# Altium project altium_v4.PrjPCB (part 1 of 2)
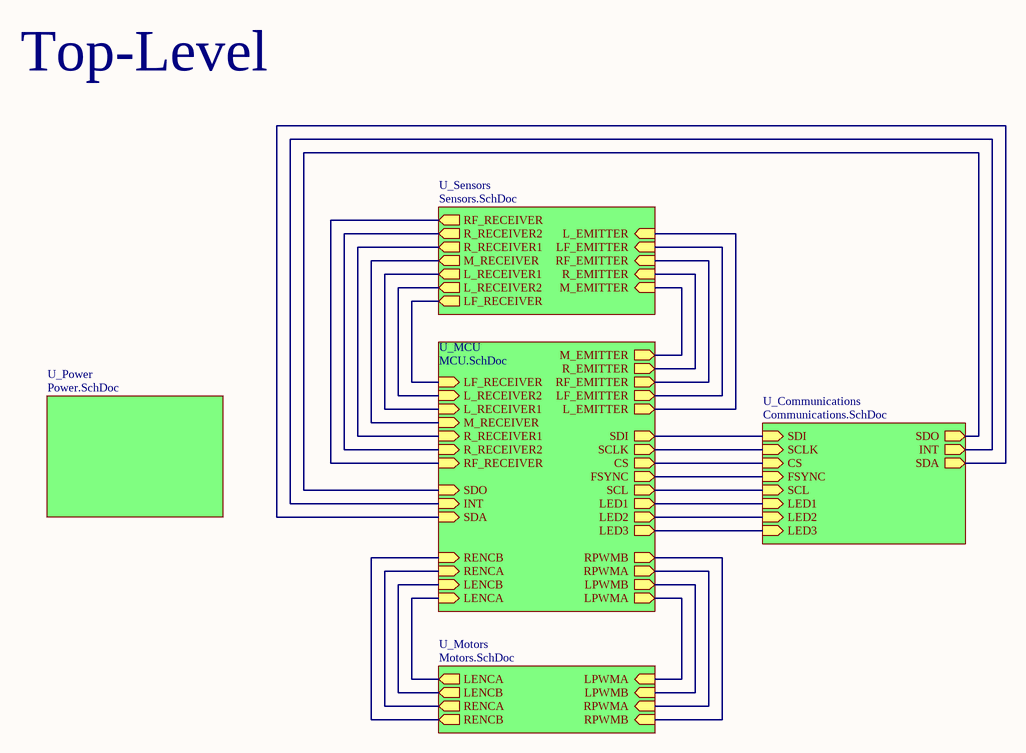
[diagram p0: Micromouse_Altium_v4.SchDoc]
6 sheets, 142 parts. Net scope: hierarchical (ports join the sheet entries above them; power ports are global).
Board file: Micromouse_Altium_v4.PcbDoc
Sheets:
  Micromouse_Altium_v4.SchDoc
    U_Motors = Motors.SchDoc
    U_Power = Power.SchDoc
    U_Sensors = Sensors.SchDoc
    U_MCU = MCU.SchDoc
    U_Communications = Communications.SchDoc

## Sheet Micromouse_Altium_v4.SchDoc
size A

### Sub-sheets
U_Communications = Communications.SchDoc: SDI (in), SCLK (in), CS (in), SDO (out), INT (out), FSYNC (in), SDA (out), SCL (in), LED1 (in), LED2 (in), LED3 (in)
U_MCU = MCU.SchDoc: SDI (out), SDO (in), SCLK (out), CS (out), FSYNC (out), INT (in), SCL (out), SDA (in), LENCA (in), LENCB (in), RENCA (in), RENCB (in), LPWMA (out), LPWMB (out), L_EMITTER (out), LF_EMITTER (out), M_EMITTER (out), R_EMITTER (out), RF_EMITTER (out), L_RECEIVER1 (in), L_RECEIVER2 (in), LF_RECEIVER (in), R_RECEIVER1 (in), R_RECEIVER2 (in), RF_RECEIVER (in), M_RECEIVER (in), RPWMA (out), RPWMB (out), LED1 (out), LED2 (out), LED3 (out)
U_Motors = Motors.SchDoc: LPWMA (in), LPWMB (in), LENCA (out), LENCB (out), RPWMA (in), RPWMB (in), RENCA (out), RENCB (out)
U_Power = Power.SchDoc: no entries
U_Sensors = Sensors.SchDoc: L_EMITTER (in), LF_EMITTER (in), RF_EMITTER (in), R_EMITTER (in), M_EMITTER (in), RF_RECEIVER (out), R_RECEIVER2 (out), R_RECEIVER1 (out), M_RECEIVER (out), L_RECEIVER1 (out), L_RECEIVER2 (out), LF_RECEIVER (out)

### Nets
NetIC1_9: sheet U_MCU/SDO, sheet U_Communications/SDO
NetIC1_11: sheet U_MCU/FSYNC, sheet U_Communications/FSYNC
NetIC1_12: sheet U_MCU/INT, sheet U_Communications/INT
NetIC1_22: sheet U_MCU/CS, sheet U_Communications/CS
NetIC1_23: sheet U_MCU/SCLK, sheet U_Communications/SCLK
NetIC1_24: sheet U_MCU/SDI, sheet U_Communications/SDI
NetIC2_1: sheet U_MCU/LED1, sheet U_Communications/LED1
NetIC3_1: sheet U_MCU/LED2, sheet U_Communications/LED2
NetIC4_1: sheet U_MCU/LED3, sheet U_Communications/LED3
NetIC5_2: sheet U_Motors/LPWMA, sheet U_MCU/LPWMA
NetIC5_4: sheet U_Motors/LPWMB, sheet U_MCU/LPWMB
NetIC6_2: sheet U_Motors/RPWMA, sheet U_MCU/RPWMA
NetIC6_4: sheet U_Motors/RPWMB, sheet U_MCU/RPWMB
NetIC10_1: sheet U_Sensors/L_EMITTER, sheet U_MCU/L_EMITTER
NetIC11_1: sheet U_Sensors/LF_EMITTER, sheet U_MCU/LF_EMITTER
NetIC12_1: sheet U_Sensors/RF_EMITTER, sheet U_MCU/RF_EMITTER
NetIC13_1: sheet U_Sensors/R_EMITTER, sheet U_MCU/R_EMITTER
NetIC14_1: sheet U_Sensors/M_EMITTER, sheet U_MCU/M_EMITTER
NetJ2_4: sheet U_Motors/LENCA, sheet U_MCU/LENCA
NetJ2_5: sheet U_Motors/LENCB, sheet U_MCU/LENCB
NetJ3_4: sheet U_Motors/RENCA, sheet U_MCU/RENCA
NetJ3_5: sheet U_Motors/RENCB, sheet U_MCU/RENCB
NetQ3_1: sheet U_Sensors/LF_RECEIVER, sheet U_MCU/LF_RECEIVER
NetQ4_1: sheet U_Sensors/L_RECEIVER2, sheet U_MCU/L_RECEIVER2
NetQ5_1: sheet U_Sensors/L_RECEIVER1, sheet U_MCU/L_RECEIVER1
NetQ6_1: sheet U_Sensors/M_RECEIVER, sheet U_MCU/M_RECEIVER
NetQ7_1: sheet U_Sensors/R_RECEIVER1, sheet U_MCU/R_RECEIVER1
NetQ8_1: sheet U_Sensors/R_RECEIVER2, sheet U_MCU/R_RECEIVER2
NetQ9_1: sheet U_Sensors/RF_RECEIVER, sheet U_MCU/RF_RECEIVER
NetR9_1: sheet U_MCU/SDA, sheet U_Communications/SDA
NetR11_1: sheet U_MCU/SCL, sheet U_Communications/SCL

### Notes on the sheet
- Top-Level

## Sheet Motors.SchDoc
size A
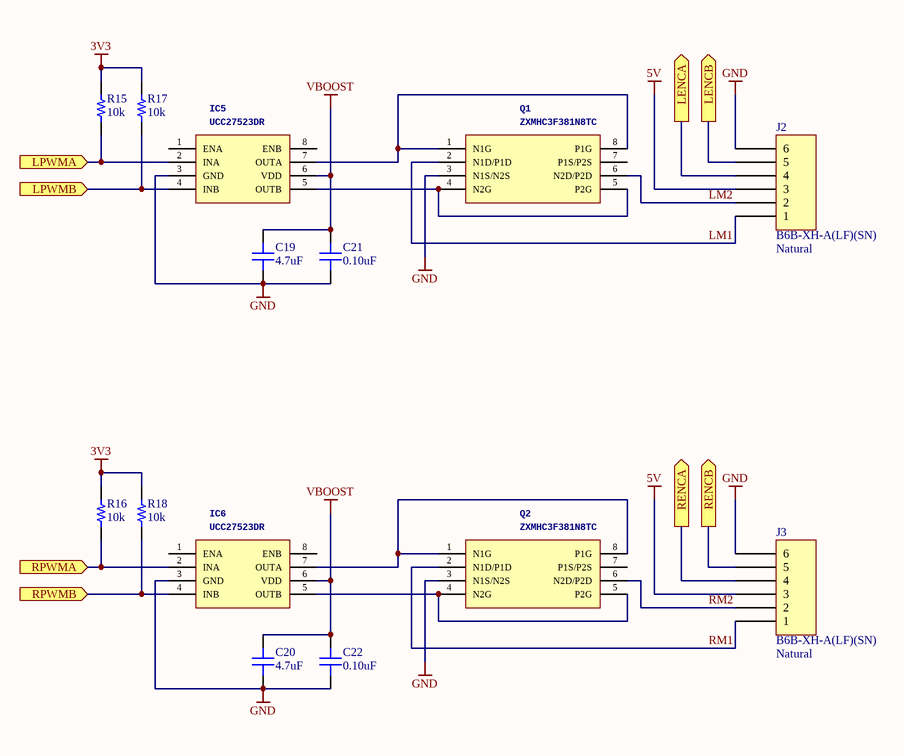
[diagram p1: Motors.SchDoc]

### Parts
C19  4.7uF  [CAP 0805/2012]
C20  4.7uF  [CAP 0805/2012]
C21  0.10uF  [CAP 0402/1005]
C22  0.10uF  [CAP 0402/1005]
IC5  UCC27523DR  [SOIC127P600X175-8N]
IC6  UCC27523DR  [SOIC127P600X175-8N]
J2  B6B-XH-A(LF)(SN)  Colour: Natural  [JST XH B6B-XH-A]
J3  B6B-XH-A(LF)(SN)  Colour: Natural  [JST XH B6B-XH-A]
Q1  ZXMHC3F381N8TC  [SOIC127P600X175-8N]
Q2  ZXMHC3F381N8TC  [SOIC127P600X175-8N]
R15  10k  [RES 0402/1005]
R16  10k  [RES 0402/1005]
R17  10k  [RES 0402/1005]
R18  10k  [RES 0402/1005]

### Ports
LENCA (out), LENCB (out), LPWMA (in), LPWMB (in), RENCA (out), RENCB (out), RPWMA (in), RPWMB (in)

### Nets
3V3: R15.2 R16.2 R17.2 R18.2
5V: J2.3 J3.3
GND: C19.1 C20.1 C21.1 C22.1 IC5.3(GND) IC6.3(GND) J2.6 J3.6 Q1.3(N1S/N2S) Q2.3(N1S/N2S)
VBOOST: C19.2 C20.2 C21.2 C22.2 IC5.6(VDD) IC6.6(VDD)
LM1: J2.1 Q1.2(N1D/P1D)
LM2: J2.2 Q1.6(N2D/P2D)
RM1: J3.1 Q2.2(N1D/P1D)
RM2: J3.2 Q2.6(N2D/P2D)
NetIC5_2: IC5.2(INA) R15.1 ; port LPWMA
NetIC5_4: IC5.4(INB) R17.1 ; port LPWMB
NetIC5_5: IC5.5(OUTB) Q1.4(N2G) Q1.5(P2G)
NetIC5_7: IC5.7(OUTA) Q1.1(N1G) Q1.8(P1G)
NetIC6_2: IC6.2(INA) R16.1 ; port RPWMA
NetIC6_4: IC6.4(INB) R18.1 ; port RPWMB
NetIC6_5: IC6.5(OUTB) Q2.4(N2G) Q2.5(P2G)
NetIC6_7: IC6.7(OUTA) Q2.1(N1G) Q2.8(P1G)
NetJ2_4: J2.4 ; port LENCA
NetJ2_5: J2.5 ; port LENCB
NetJ3_4: J3.4 ; port RENCA
NetJ3_5: J3.5 ; port RENCB

Not connected (* = marked no-connect by the designer): IC5 1(ENA) 8(ENB); IC6 1(ENA) 8(ENB); Q1 7(P1S/P2S); Q2 7(P1S/P2S)

### Library data of the parts
C19 C20 = CC0805ZRY5V6BB475: CAP CER 4.7UF 10V Y5V 0805; Manufacturer: Yageo; TemperatureRange: -30C ~ 85C; TemperatureCoefficient: Y5V (F); Tolerance: -20%, +80%; Value: 4.7uF; Part Number: CC0805ZRY5V6BB475; PartId: 13806; Supplier 1: Digi-Key; Supplier Part Number 1: 311-1371-2-ND; ComponentLink1Description: Datasheet; ComponentLink1URL: http://www.yageo.com/documents/recent/UPY-GPHC_Y5V_6.3V-to-50V_6.pdf; ComponentLink2Description: Digi-Key Listing; ComponentLink2URL: https://www.digikey.com/product-detail/en/yageo/CC0805ZRY5V6BB475/311-1371-2-ND/2103109; Voltage: 10V; Price: 0.0145; Device Package: 0805 (2012 Metric)
C21 C22 = GCM155R71C104KA55D: CAP CER 0.1UF 16V X7R 0402; Manufacturer: Murata Electronics North America; TemperatureRange: -55C ~ 125C; Tolerance: 10%; Value: 0.10uF; Part Number: GCM155R71C104KA55D; PartId: 12362; Supplier 1: Digi-Key; Supplier Part Number 1: 490-4759-2-ND; ComponentLink1Description: Datasheet; ComponentLink1URL: http://www.murata.com/~/media/webrenewal/support/library/catalog/products/capacitor/mlcc/c03e.ashx; ComponentLink2Description: Digi-Key Listing; ComponentLink2URL: https://www.digikey.com/product-detail/en/murata-electronics-north-america/GCM155R71C104KA55D/490-4759-2-ND/1641633; TemperatureCoefficient: X7R; Voltage: 16V; Price: 0.0088; Device Package: 0402 (1005 Metric)
IC5 IC6 = UCC27523DR: MANUFACTURER_NAME: Texas Instruments; GateName_1: G$1; SymbolName_1: UCC27523DR; LibraryName: micromousev2Parts; DeviceSetName: UCC27523DR; Package: SOIC127P600X175-8N; ARROW_PART_NUMBER: UCC27523DR; ARROW_PRICE/STOCK: https://www.arrow.com/en/products/ucc27523dr/texas-instruments; HEIGHT: 1.75mm; MANUFACTURER_PART_NUMBER: UCC27523DR
J2 J3 = B6B-XH-A(LF)(SN): CONN HEADER XH TOP 6POS 2.5MM; Manufacturer: JST Sales America Inc.; Pitch: 0.098" (2.50mm); Number Of Positions: 6; Part Number: B6B-XH-A(LF)(SN); PartId: 16453; Supplier 1: Digi-Key; Supplier Part Number 1: 455-2271-ND; ComponentLink1Description: Datasheet; ComponentLink1URL: http://www.jst-mfg.com/product/pdf/eng/eXH.pdf; ComponentLink2Description: Digi-Key Listing; ComponentLink2URL: http://www.digikey.com/product-detail/en/jst-sales-america-inc/B6B-XH-A(LF)(SN)/455-2271-ND/1000381; Price: 0.27; Type: Header, Shrouded; Contact Finish: Tin; Fastening Type: Detent Lock; Number Of Rows: 1; Series: XH
Q1 Q2 = ZXMHC3F381N8TC: MANUFACTURER_NAME: Diodes Inc.; GateName_1: G$1; ALLIED_NUMBER: 70438802; SymbolName_1: ZXMHC3F381N8TC; LibraryName: micromousev2Parts; DeviceSetName: ZXMHC3F381N8TC; Package: SOIC127P600X175-8N; ALLIED_PRICE/STOCK: https://www.alliedelec.com/diodes-inc-zxmhc3f381n8tc/70438802/; ARROW_PART_NUMBER: ZXMHC3F381N8TC; ARROW_PRICE/STOCK: https://www.arrow.com/en/products/zxmhc3f381n8tc/diodes-incorporated; HEIGHT: 1.75mm; MANUFACTURER_PART_NUMBER: ZXMHC3F381N8TC; RS_PART_NUMBER: 7515344P; RS_PRICE/STOCK: http://uk.rs-online.com/web/p/products/7515344P
R15-R18 = ERJ-2RKF1002X: RES SMD 10K OHM 1% 1/10W 0402; Manufacturer: Panasonic Electronic Components; TemperatureRange: -55C ~ 155C; TemperatureCoefficient: 100ppm/C; PowerRating: 0.1W, 1/10W; Value: 10k; Part Number: ERJ-2RKF1002X; PartId: 1; Supplier 1: Digi-Key; Supplier Part Number 1: P10.0KLTR-ND; ComponentLink1Description: Datasheet; ComponentLink1URL: http://industrial.panasonic.com/www-cgi/jvcr13pz.cgi?E+PZ+3+AOA0002+ERJ2RKF1002X+7+WW; ComponentLink2Description: Digikey listing; ComponentLink2URL: http://digikey.com/product-detail/en/ERJ-2RKF1002X/P10.0KLTR-ND/192073; Tolerance: 1%; Price: 0.0043; Type: Thick Film; Device Package: 0402 (1005 Metric)

## Sheet Power.SchDoc
size A
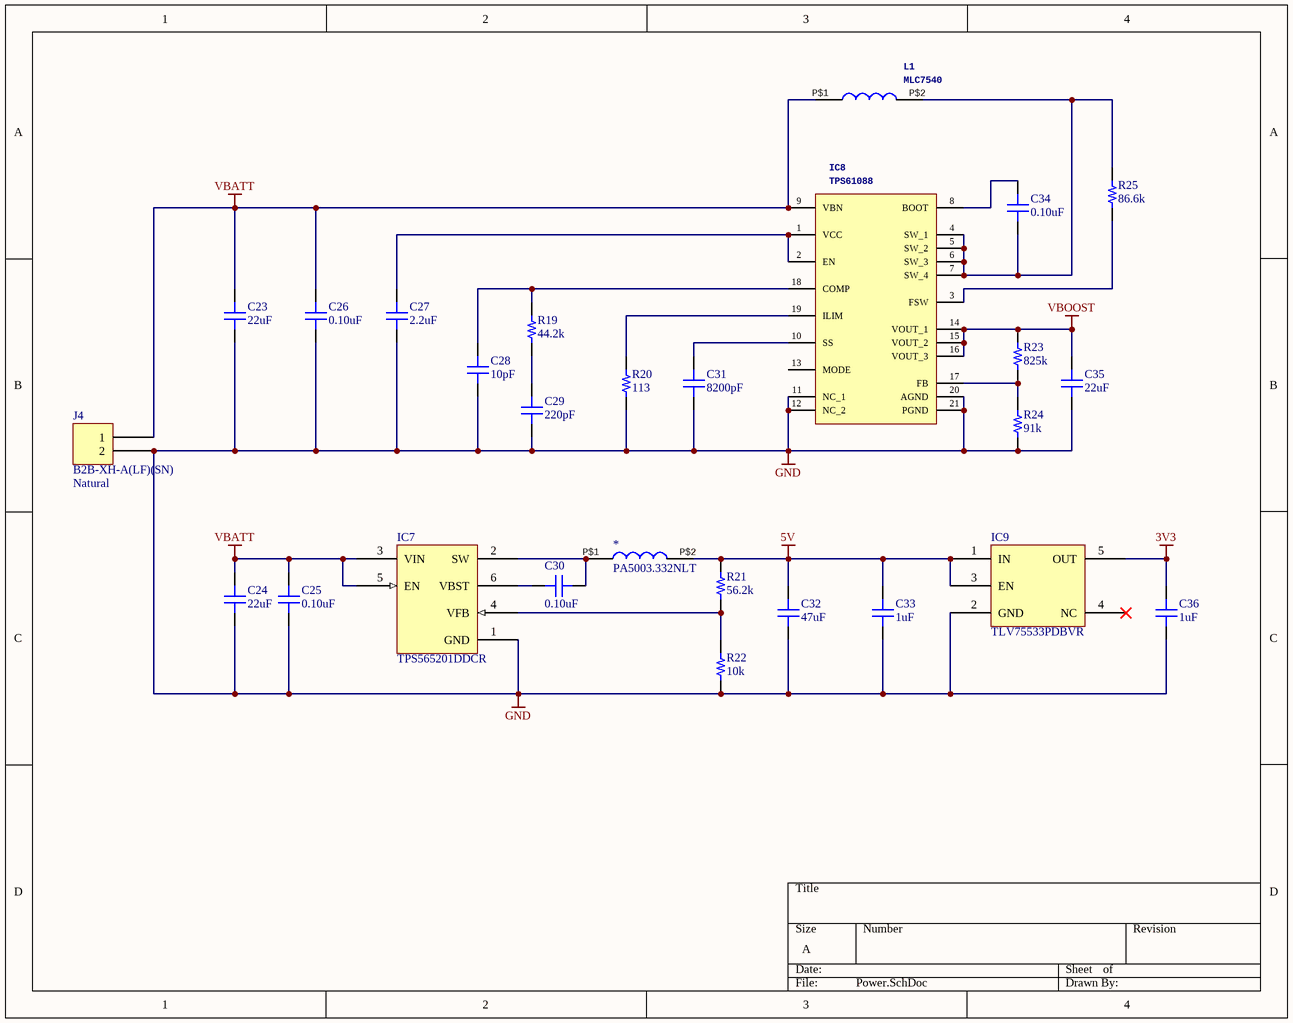
[diagram p2: Power.SchDoc]

### Parts
*  PA5003.332NLT  [PA5003]
C23  22uF  [CAP 1210/3225 - 2.8MM]
C24  22uF  [CAP 0805/2012]
C25  0.10uF  [CAP 0402/1005]
C26  0.10uF  [CAP 0603/1608]
C27  2.2uF  [CAP 0603/1608]
C28  10pF  [CAP 0402/1005]
C29  220pF  [CAP 0402/1005]
C30  0.10uF  [CAP 0402/1005]
C31  8200pF  [CAP 0603/1608]
C32  47uF  [CAP 1206/3216]
C33  1uF  [CAP 0603/1608]
C34  0.10uF  [CAP 0402/1005]
C35  22uF  [CAP 1210/3225 - 2.8MM]
C36  1uF  [CAP 0603/1608]
IC7  TPS565201DDCR  [DDC]
IC8  TPS61088  [RHL(R-PVQFN-N20)_1]
IC9  TLV75533PDBVR  [SOT95P280X145-5N]
J4  B2B-XH-A(LF)(SN)  Colour: Natural  [JST XH B2B-XH-A]
L1  MLC7540  [MLC7540]
R19  44.2k  [RES 0402/1005]
R20  113  [RES 0402/1005]
R21  56.2k  [RES 0402/1005]
R22  10k  [RES 0402/1005]
R23  825k  [RES 0402/1005]
R24  91k  [RES 0402/1005]
R25  86.6k  [RES 0402/1005]

### Nets
3V3: C36.2 IC9.5(OUT)
5V: *.P$2 C32.2 C33.2 IC9.1(IN) IC9.3(EN) R21.2
GND: C23.1 C24.1 C25.1 C26.1 C27.1 C28.1 C29.1 C31.1 C32.1 C33.1 C35.1 C36.1 IC7.1(GND) IC8.11(NC_1) IC8.12(NC_2) IC8.20(AGND) IC8.21(PGND) IC9.2(GND) J4.2 R20.1 R22.1 R24.1
VBATT: C23.2 C24.2 C25.2 C26.2 IC7.3(VIN) IC7.5(EN) IC8.9(VBN) J4.1 L1.P$1
VBOOST: C35.2 IC8.14(VOUT_1) IC8.15(VOUT_2) IC8.16(VOUT_3) R23.2
Net*_P$1: *.P$1 C30.1 IC7.2(SW)
NetC27_2: C27.2 IC8.1(VCC) IC8.2(EN)
NetC28_2: C28.2 IC8.18(COMP) R19.2
NetC29_2: C29.2 R19.1
NetC30_2: C30.2 IC7.6(VBST)
NetC31_2: C31.2 IC8.10(SS)
NetC34_1: C34.1 IC8.4(SW_1) IC8.5(SW_2) IC8.6(SW_3) IC8.7(SW_4) L1.P$2 R25.2
NetC34_2: C34.2 IC8.8(BOOT)
NetIC7_4: IC7.4(VFB) R21.1 R22.2
NetIC8_3: IC8.3(FSW) R25.1
NetIC8_17: IC8.17(FB) R23.1 R24.2
NetIC8_19: IC8.19(ILIM) R20.2

Not connected (* = marked no-connect by the designer): IC8 13(MODE); IC9 4(NC)*

### Library data of the parts
* = PA5003.332NLT: pin to pad: P$1>1 P$2>2
C23 C35 = TMK325B7226KMHT: CAP CER 22UF 25V X7R 1210; Manufacturer: Taiyo Yuden; TemperatureRange: -55C ~ 125C; Tolerance: 20%; Value: 22uF; Part Number: TMK325B7226KMHT; PartId: 19379; Supplier 1: Digi-Key; Supplier Part Number 1: 587-4337-2-ND; ComponentLink1Description: Datasheet; ComponentLink1URL: http://ds.yuden.co.jp/TYCOMPAS/ut/detail.do?productNo=TMK325B7226KMHT&fileName=TMK325B7226KMHT_SS&mode=specSheetDownload; ComponentLink2Description: Digi-Key Listing; ComponentLink2URL: https://www.digikey.com/product-detail/en/taiyo-yuden/TMK325B7226KMHT/587-4337-2-ND/5400883; TemperatureCoefficient: X7R; Voltage: 25V; Price: 0.5926; Device Package: 1210 (3225 Metric)
C24 = CL21A226MOQNNNE: CAP CER 22UF 16V X5R 0805; Manufacturer: Samsung Electro-Mechanics America, Inc.; TemperatureRange: -55C ~ 85C; Tolerance: 20%; Value: 22uF; Part Number: CL21A226MOQNNNE; PartId: 13784; Supplier 1: Digi-Key; Supplier Part Number 1: 1276-2909-2-ND; ComponentLink1Description: Datasheet; ComponentLink1URL: http://www.samsungsem.com/kr/support/product-search/mlcc/CL21A226MOQNNNE.jsp; ComponentLink2Description: Digi-Key Listing; ComponentLink2URL: https://www.digikey.com/product-detail/en/samsung-electro-mechanics-america-inc/CL21A226MOQNNNE/1276-2909-2-ND/3888567; TemperatureCoefficient: X5R; Voltage: 16V; Price: 0.1411; Device Package: 0805 (2012 Metric)
C25 = GRM155R71A104KA01D: CAP CER 0.1UF 10V X7R 0402; Manufacturer: Murata Electronics North America; TemperatureRange: -55C ~ 125C; Tolerance: 10%; Value: 0.10uF; Part Number: GRM155R71A104KA01D; PartId: 12364; Supplier 1: Digi-Key; Supplier Part Number 1: 490-6321-2-ND; ComponentLink1Description: Datasheet; ComponentLink1URL: http://www.murata.com/~/media/webrenewal/support/library/catalog/products/capacitor/mlcc/c02e.pdf; ComponentLink2Description: Digi-Key Listing; ComponentLink2URL: https://www.digikey.com/product-detail/en/murata-electronics-north-america/GRM155R71A104KA01D/490-6321-2-ND/2610881; TemperatureCoefficient: X7R; Voltage: 10V; Price: 0.0046; Device Package: 0402 (1005 Metric)
C26 = C0603C104K4RACTU: CAP CER 0.1UF 16V X7R 0603; Part Number: C0603X104K4RACTU; Manufacturer: Kemet; TemperatureRange: -55C ~ 125C; Tolerance: 10%; Value: 0.10uF; PartId: 12975; Supplier 1: Digi-Key; Supplier Part Number 1: 399-1096-2-ND; ComponentLink1Description: Datasheet; ComponentLink1URL: http://www.kemet.com/docfinder?Partnumber=C0603C104K4RACTU; ComponentLink2Description: Digi-Key Listing; ComponentLink2URL: https://www.digikey.com/product-detail/en/kemet/C0603C104K4RACTU/399-1096-2-ND/411095; TemperatureCoefficient: X7R; Voltage: 16V; Price: 0.0041; Device Package: 0603 (1608 Metric)
C27 = C1608X5R1V225K080AC: CAP CER 2.2UF 35V X5R 0603; Manufacturer: TDK Corporation; TemperatureRange: -55C ~ 85C; Tolerance: 10%; Value: 2.2uF; Part Number: C1608X5R1V225K080AC; PartId: 13143; Supplier 1: Digi-Key; Supplier Part Number 1: 445-8025-2-ND; ComponentLink1Description: Datasheet; ComponentLink1URL: https://product.tdk.com/info/en/catalog/datasheets/mlcc_commercial_general_en.pdf; ComponentLink2Description: Digi-Key Listing; ComponentLink2URL: https://www.digikey.com/product-detail/en/tdk-corporation/C1608X5R1V225K080AC/445-8025-2-ND/2792255; TemperatureCoefficient: X5R; Voltage: 35V; Price: 0.0462; Device Package: 0603 (1608 Metric)
C28 = C0402C100J3GACTU: CAP CER 10PF 25V NP0 0402; Manufacturer: Kemet; TemperatureRange: -55C ~ 125C; TemperatureCoefficient: C0G, NP0; Tolerance: 5%; Value: 10pF; Part Number: C0402C100J3GACTU; PartId: 12402; Supplier 1: Digi-Key; Supplier Part Number 1: 399-7746-2-ND; ComponentLink1Description: Datasheet; ComponentLink1URL: http://www.kemet.com/docfinder?Partnumber=C0402C100J3GACTU; ComponentLink2Description: Digi-Key Listing; ComponentLink2URL: https://www.digikey.com/product-detail/en/kemet/C0402C100J3GACTU/399-7746-2-ND/2196151; Voltage: 25V; Price: 0.0029; Device Package: 0402 (1005 Metric)
C29 = CC0402JRNPO8BN221: CAP CER 220PF 25V NPO 0402; Manufacturer: Yageo; TemperatureRange: -55C ~ 125C; TemperatureCoefficient: C0G, NP0; Tolerance: 5%; Value: 220pF; Part Number: CC0402JRNPO8BN221; PartId: 5136; Supplier 1: Digi-Key; Supplier Part Number 1: 311-1026-2-ND; ComponentLink1Description: Datasheet; ComponentLink1URL: http://www.yageo.com/documents/recent/UPY-GP_NP0_16V-to-50V_10.pdf; ComponentLink2Description: Digi-Key listing; ComponentLink2URL: http://digikey.com/product-detail/en/CC0402JRNPO8BN221/311-1026-2-ND/302760; Voltage: 25V; Price: 0.0176; Type: -; Device Package: 0402 (1005 Metric)
C30 = GRM155R71A104KA01D: CAP CER 0.1UF 10V X7R 0402; Part Number: GRM155R71E104KE14D; Manufacturer: Murata Electronics North America; TemperatureRange: -55C ~ 125C; Tolerance: 10%; Voltage: 25V; Value: 0.10uF; PartId: 12364; Supplier 1: Digi-Key; Supplier Part Number 1: 490-6321-2-ND; ComponentLink1Description: Datasheet; ComponentLink1URL: http://www.murata.com/~/media/webrenewal/support/library/catalog/products/capacitor/mlcc/c02e.pdf; ComponentLink2Description: Digi-Key Listing; ComponentLink2URL: https://www.digikey.com/product-detail/en/murata-electronics-north-america/GRM155R71A104KA01D/490-6321-2-ND/2610881; TemperatureCoefficient: X7R; Price: 0.0046; Device Package: 0402 (1005 Metric)
C31 = GRM188R71H822KA01D: CAP CER 8200PF 50V X7R 0603; Manufacturer: Murata Electronics North America; TemperatureRange: -55C ~ 125C; Tolerance: 10%; Value: 8200pF; Part Number: GRM188R71H822KA01D; PartId: 13328; Supplier 1: Digi-Key; Supplier Part Number 1: 490-1510-2-ND; ComponentLink1Description: Datasheet; ComponentLink1URL: http://www.murata.com/~/media/webrenewal/support/library/catalog/products/capacitor/mlcc/c02e.pdf; ComponentLink2Description: Digi-Key Listing; ComponentLink2URL: https://www.digikey.com/product-detail/en/murata-electronics-north-america/GRM188R71H822KA01D/490-1510-2-ND/587160; TemperatureCoefficient: X7R; Voltage: 50V; Price: 0.0154; Device Package: 0603 (1608 Metric)
C32 = CL31A476MPHNNNE: CAP CER 47UF 10V X5R 1206; Manufacturer: Samsung Electro-Mechanics America, Inc.; TemperatureRange: -55C ~ 85C; Tolerance: 20%; Value: 47uF; Part Number: CL31A476MPHNNNE; PartId: 15809; Supplier 1: Digi-Key; Supplier Part Number 1: 1276-3063-2-ND; ComponentLink1Description: Datasheet; ComponentLink1URL: //media.digikey.com/pdf/Data%20Sheets/Samsung%20PDFs/CL31A476MPHNNNE_Spec.pdf; ComponentLink2Description: Digi-Key Listing; ComponentLink2URL: https://www.digikey.com/product-detail/en/samsung-electro-mechanics-america-inc/CL31A476MPHNNNE/1276-3063-2-ND/3888721; TemperatureCoefficient: X5R; Voltage: 10V; Price: 0.2455; Device Package: 1206 (3216 Metric)
C33 C36 = CL10F105ZP8NNNC: CAP CER 1UF 10V Y5V 0603; Manufacturer: Samsung Electro-Mechanics America, Inc.; TemperatureRange: -30C ~ 85C; TemperatureCoefficient: Y5V (F); Tolerance: -20%, +80%; Value: 1uF; Part Number: CL10F105ZP8NNNC; PartId: 13159; Supplier 1: Digi-Key; Supplier Part Number 1: 1276-1041-2-ND; ComponentLink1Description: Datasheet; ComponentLink1URL: http://www.samsungsem.com/kr/support/product-search/mlcc/CL10F105ZP8NNNC.jsp; ComponentLink2Description: Digi-Key Listing; ComponentLink2URL: https://www.digikey.com/product-detail/en/samsung-electro-mechanics-america-inc/CL10F105ZP8NNNC/1276-1041-2-ND/3886699; Voltage: 10V; Price: 0.006; Device Package: 0603 (1608 Metric)
C34 = GRM155R61C104KA88D: CAP CER 0.1UF 16V X5R 0402; Manufacturer: Murata Electronics North America; TemperatureRange: -55C ~ 85C; Tolerance: 10%; Value: 0.10uF; Part Number: GRM155R61C104KA88D; PartId: 12359; Supplier 1: Digi-Key; Supplier Part Number 1: 490-5415-2-ND; ComponentLink1Description: Datasheet; ComponentLink1URL: http://www.murata.com/~/media/webrenewal/support/library/catalog/products/capacitor/mlcc/c02e.pdf; ComponentLink2Description: Digi-Key Listing; ComponentLink2URL: https://www.digikey.com/product-detail/en/murata-electronics-north-america/GRM155R61C104KA88D/490-5415-2-ND/2175201; TemperatureCoefficient: X5R; Voltage: 16V; Price: 0.0027; Device Package: 0402 (1005 Metric)
IC8 = TPS61088RHLR: MANUFACTURER_NAME: Texas Instruments; GateName_1: G$1; SymbolName_1: TPS61088RHLR; LibraryName: micromousev2Parts; DeviceSetName: TPS61088RHLR; Package: RHL(R-PVQFN-N20)_1; ARROW_PART_NUMBER: TPS61088RHLR; ARROW_PRICE/STOCK: https://www.arrow.com/en/products/tps61088rhlr/texas-instruments; HEIGHT: mm; MANUFACTURER_PART_NUMBER: TPS61088RHLR
J4 = B2B-XH-A(LF)(SN): CONN HEADER XH TOP 2POS 2.5MM; Manufacturer: JST Sales America Inc.; Pitch: 0.098" (2.50mm); Number Of Positions: 2; Part Number: B2B-XH-A(LF)(SN); PartId: 16449; Supplier 1: Digi-Key; Supplier Part Number 1: 455-2247-ND; ComponentLink1Description: Datasheet; ComponentLink1URL: http://www.jst-mfg.com/product/pdf/eng/eXH.pdf; ComponentLink2Description: Digi-Key Listing; ComponentLink2URL: http://www.digikey.com/product-detail/en/jst-sales-america-inc/B2B-XH-A(LF)(SN)/455-2247-ND/1651045; Price: 0.15; Type: Header, Shrouded; Contact Finish: Tin; Fastening Type: Detent Lock; Number Of Rows: 1; Series: XH
L1 = MLC7540: GateName_1: G$1; SymbolName_1: SDR0302-1R2ML; LibraryName: micromousev2Parts; DeviceSetName: MLC7540; Package: MLC7540
R19 = ERJ-2RKF4422X: RES SMD 44.2K OHM 1% 1/10W 0402; Manufacturer: Panasonic Electronic Components; TemperatureRange: -55C ~ 155C; TemperatureCoefficient: 100ppm/C; PowerRating: 0.1W, 1/10W; Value: 44.2k; Part Number: ERJ-2RKF4422X; PartId: 253; Supplier 1: Digi-Key; Supplier Part Number 1: P44.2KLTR-ND; ComponentLink1Description: Datasheet; ComponentLink1URL: http://industrial.panasonic.com/www-cgi/jvcr13pz.cgi?E+PZ+3+AOA0002+ERJ2RKF4422X+7+WW; ComponentLink2Description: Digikey listing; ComponentLink2URL: http://digikey.com/product-detail/en/ERJ-2RKF4422X/P44.2KLTR-ND/192363; Tolerance: 1%; Price: 0.0043; Type: Thick Film; Device Package: 0402 (1005 Metric)
R20 = ERJ-2RKF1130X: RES SMD 113 OHM 1% 1/10W 0402; Manufacturer: Panasonic Electronic Components; TemperatureRange: -55C ~ 155C; TemperatureCoefficient: 100ppm/C; PowerRating: 0.1W, 1/10W; Value: 113; Part Number: ERJ-2RKF1130X; PartId: 43; Supplier 1: Digi-Key; Supplier Part Number 1: P113LTR-ND; ComponentLink1Description: Datasheet; ComponentLink1URL: http://industrial.panasonic.com/www-cgi/jvcr13pz.cgi?E+PZ+3+AOA0002+ERJ2RKF1130X+7+WW; ComponentLink2Description: Digikey listing; ComponentLink2URL: http://digikey.com/product-detail/en/ERJ-2RKF1130X/P113LTR-ND/192098; Tolerance: 1%; Price: 0.0035; Type: Thick Film; Device Package: 0402 (1005 Metric)
R21 = RC0402FR-070RL: RES SMD 0.0OHM JUMPER 1/16W 0402; Part Number: RC0402FR-0756K2L; Manufacturer: Yageo; TemperatureRange: -55C ~ 155C; PowerRating: 0.063W, 1/16W; Value: 56.2k; PartId: 16137; Supplier 1: Digi-Key; Supplier Part Number 1: 311-0.0LRTR-ND; ComponentLink1Description: Datasheet; ComponentLink1URL: http://www.yageo.com/documents/recent/PYu-RC_Group_51_RoHS_L_04.pdf; ComponentLink2Description: Digi-Key Listing; ComponentLink2URL: https://www.digikey.com/product-detail/en/yageo/RC0402FR-070RL/311-0.0LRTR-ND/2827570; Tolerance: Jumper; Price: 0.0022; Device Package: 0402 (1005 Metric)
R22 = RC0402FR-070RL: RES SMD 0.0OHM JUMPER 1/16W 0402; Part Number: RC0402JR-1310KL; Manufacturer: Yageo; TemperatureRange: -55C ~ 155C; PowerRating: 0.063W, 1/16W; Value: 10k; PartId: 16137; Supplier 1: Digi-Key; Supplier Part Number 1: 311-0.0LRTR-ND; ComponentLink1Description: Datasheet; ComponentLink1URL: http://www.yageo.com/documents/recent/PYu-RC_Group_51_RoHS_L_04.pdf; ComponentLink2Description: Digi-Key Listing; ComponentLink2URL: https://www.digikey.com/product-detail/en/yageo/RC0402FR-070RL/311-0.0LRTR-ND/2827570; Tolerance: Jumper; Price: 0.0022; Device Package: 0402 (1005 Metric)
R23 = ERJ-2RKF8253X: RES SMD 825K OHM 1% 1/10W 0402; Manufacturer: Panasonic Electronic Components; TemperatureRange: -55C ~ 155C; TemperatureCoefficient: 100ppm/C; PowerRating: 0.1W, 1/10W; Value: 825k; Part Number: ERJ-2RKF8253X; PartId: 136; Supplier 1: Digi-Key; Supplier Part Number 1: P825KLTR-ND; ComponentLink1Description: Datasheet; ComponentLink1URL: http://industrial.panasonic.com/www-cgi/jvcr13pz.cgi?E+PZ+3+AOA0002+ERJ2RKF8253X+7+WW; ComponentLink2Description: Digikey listing; ComponentLink2URL: http://digikey.com/product-detail/en/ERJ-2RKF8253X/P825KLTR-ND/192492; Tolerance: 1%; Price: 0.0035; Type: Thick Film; Device Package: 0402 (1005 Metric)
R24 = ERJ-2RKF9102X: RES SMD 91K OHM 1% 1/10W 0402; Manufacturer: Panasonic Electronic Components; TemperatureRange: -55C ~ 155C; TemperatureCoefficient: 100ppm/C; PowerRating: 0.1W, 1/10W; Value: 91k; Part Number: ERJ-2RKF9102X; PartId: 384; Supplier 1: Digi-Key; Supplier Part Number 1: P91.0KLTR-ND; ComponentLink1Description: Datasheet; ComponentLink1URL: http://industrial.panasonic.com/www-cgi/jvcr13pz.cgi?E+PZ+3+AOA0002+ERJ2RKF9102X+7+WW; ComponentLink2Description: Digikey listing; ComponentLink2URL: http://digikey.com/product-detail/en/ERJ-2RKF9102X/P91.0KLTR-ND/1746293; Tolerance: 1%; Price: 0.0043; Type: Thick Film; Device Package: 0402 (1005 Metric)
R25 = ERJ-2RKF8662X: RES SMD 86.6K OHM 1% 1/10W 0402; Manufacturer: Panasonic Electronic Components; TemperatureRange: -55C ~ 155C; TemperatureCoefficient: 100ppm/C; PowerRating: 0.1W, 1/10W; Value: 86.6k; Part Number: ERJ-2RKF8662X; PartId: 489; Supplier 1: Digi-Key; Supplier Part Number 1: P86.6KLTR-ND; ComponentLink1Description: Datasheet; ComponentLink1URL: http://industrial.panasonic.com/www-cgi/jvcr13pz.cgi?E+PZ+3+AOA0002+ERJ2RKF8662X+7+WW; ComponentLink2Description: Digikey listing; ComponentLink2URL: http://digikey.com/product-detail/en/ERJ-2RKF8662X/P86.6KLTR-ND/192498; Tolerance: 1%; Price: 0.0043; Type: Thick Film; Device Package: 0402 (1005 Metric)

## Sheet Sensors.SchDoc
size A
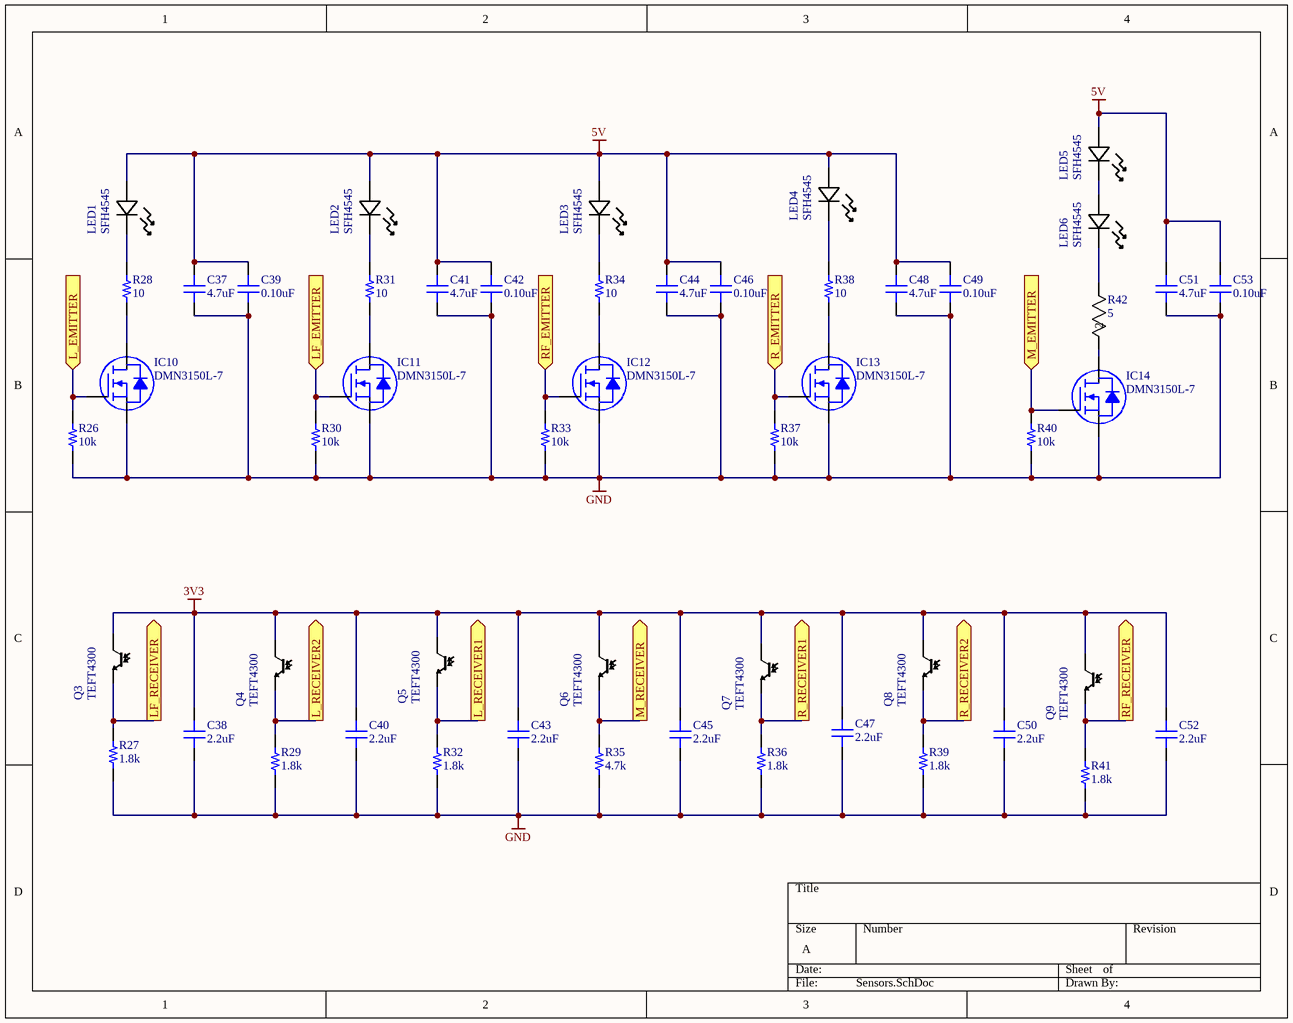
[diagram p3: Sensors.SchDoc]

### Parts
C37  4.7uF  [CAP 0805/2012]
C38  2.2uF  [CAP 0402/1005]
C39  0.10uF  [CAP 0603/1608]
C40  2.2uF  [CAP 0402/1005]
C41  4.7uF  [CAP 0805/2012]
C42  0.10uF  [CAP 0603/1608]
C43  2.2uF  [CAP 0402/1005]
C44  4.7uF  [CAP 0805/2012]
C45  2.2uF  [CAP 0402/1005]
C46  0.10uF  [CAP 0603/1608]
C47  2.2uF  [CAP 0402/1005]
C48  4.7uF  [CAP 0805/2012]
C49  0.10uF  [CAP 0603/1608]
C50  2.2uF  [CAP 0402/1005]
C51  4.7uF  [CAP 0805/2012]
C52  2.2uF  [CAP 0402/1005]
C53  0.10uF  [CAP 0603/1608]
IC10  DMN3150L-7  [DIODES SOT-23-3]
IC11  DMN3150L-7  [DIODES SOT-23-3]
IC12  DMN3150L-7  [DIODES SOT-23-3]
IC13  DMN3150L-7  [DIODES SOT-23-3]
IC14  DMN3150L-7  [DIODES SOT-23-3]
LED1  SFH4545  [LED_TLH]
LED2  SFH4545  [LED_TLH]
LED3  SFH4545  [LED_TLH]
LED4  SFH4545  [LED_TLH]
LED5  SFH4545  [LED_TLH]
LED6  SFH4545  [LED_TLH]
Q3  TEFT4300  [LED_TLH]
Q4  TEFT4300  [LED_TLH]
Q5  TEFT4300  [LED_TLH]
Q6  TEFT4300  [LED_TLH]
Q7  TEFT4300  [LED_TLH]
Q8  TEFT4300  [LED_TLH]
Q9  TEFT4300  [LED_TLH]
R26  10k  [RES 0402/1005]
R27  1.8k  [RES 0402/1005]
R28  10  [RES 0603/1608]
R29  1.8k  [RES 0402/1005]
R30  10k  [RES 0402/1005]
R31  10  [RES 0603/1608]
R32  1.8k  [RES 0402/1005]
R33  10k  [RES 0402/1005]
R34  10  [RES 0603/1608]
R35  4.7k  [RES 0402/1005]
R36  1.8k  [RES 0402/1005]
R37  10k  [RES 0402/1005]
R38  10  [RES 0603/1608]
R39  1.8k  [RES 0402/1005]
R40  10k  [RES 0402/1005]
R41  1.8k  [RES 0402/1005]
R42  5  [RES_WSC_2515]

### Ports
L_EMITTER (in), L_RECEIVER1 (out), L_RECEIVER2 (out), LF_EMITTER (in), LF_RECEIVER (out), M_EMITTER (in), M_RECEIVER (out), R_EMITTER (in), R_RECEIVER1 (out), R_RECEIVER2 (out), RF_EMITTER (in), RF_RECEIVER (out)

### Nets
3V3: C38.1 C40.1 C43.1 C45.1 C47.1 C50.1 C52.1 Q3.2 Q4.2 Q5.2 Q6.2 Q7.2 Q8.2 Q9.2
5V: C37.2 C39.2 C41.2 C42.2 C44.2 C46.2 C48.2 C49.2 C51.2 C53.2 LED1.2 LED2.2 LED3.2 LED4.2 LED5.2
GND: C37.1 C38.2 C39.1 C40.2 C41.1 C42.1 C43.2 C44.1 C45.2 C46.1 C47.2 C48.1 C49.1 C50.2 C51.1 C52.2 C53.1 IC10.3(S) IC11.3(S) IC12.3(S) IC13.3(S) IC14.3(S) R26.1 R27.1 R29.1 R30.1 R32.1 R33.1 R35.1 R36.1 R37.1 R39.1 R40.1 R41.1
NetIC10_1: IC10.1(G) R26.2 ; port L_EMITTER
NetIC10_2: IC10.2(D) R28.2
NetIC11_1: IC11.1(G) R30.2 ; port LF_EMITTER
NetIC11_2: IC11.2(D) R31.2
NetIC12_1: IC12.1(G) R33.2 ; port RF_EMITTER
NetIC12_2: IC12.2(D) R34.2
NetIC13_1: IC13.1(G) R37.2 ; port R_EMITTER
NetIC13_2: IC13.2(D) R38.2
NetIC14_1: IC14.1(G) R40.2 ; port M_EMITTER
NetIC14_2: IC14.2(D) R42.2
NetLED1_1: LED1.1 R28.1
NetLED2_1: LED2.1 R31.1
NetLED3_1: LED3.1 R34.1
NetLED4_1: LED4.1 R38.1
NetLED5_1: LED5.1 LED6.2
NetLED6_1: LED6.1 R42.1
NetQ3_1: Q3.1 R27.2 ; port LF_RECEIVER
NetQ4_1: Q4.1 R29.2 ; port L_RECEIVER2
NetQ5_1: Q5.1 R32.2 ; port L_RECEIVER1
NetQ6_1: Q6.1 R35.2 ; port M_RECEIVER
NetQ7_1: Q7.1 R36.2 ; port R_RECEIVER1
NetQ8_1: Q8.1 R39.2 ; port R_RECEIVER2
NetQ9_1: Q9.1 R41.2 ; port RF_RECEIVER

### Library data of the parts
C37 C41 C44 C48 C51 = CC0805ZRY5V6BB475: as C19 on sheet Motors; Value: 4.7uF; Part Number: CC0805ZRY5V6BB475; PartId: 13806; Supplier 1: Digi-Key; Supplier Part Number 1: 311-1371-2-ND; ComponentLink1Description: Datasheet; ComponentLink1URL: http://www.yageo.com/documents/recent/UPY-GPHC_Y5V_6.3V-to-50V_6.pdf; ComponentLink2Description: Digi-Key Listing; ComponentLink2URL: https://www.digikey.com/product-detail/en/yageo/CC0805ZRY5V6BB475/311-1371-2-ND/2103109; Voltage: 10V; Price: 0.0145; Device Package: 0805 (2012 Metric)
C38 C40 C43 C45 C47 C50 C52 = CL05A225KP5NSNC: CAP CER 2.2UF 10V X5R 0402; Manufacturer: Samsung Electro-Mechanics America, Inc.; TemperatureRange: -55C ~ 85C; Tolerance: 10%; Value: 2.2uF; Part Number: CL05A225KP5NSNC; PartId: 12898; Supplier 1: Digi-Key; Supplier Part Number 1: 1276-1108-2-ND; ComponentLink1Description: Datasheet; ComponentLink1URL: http://www.samsungsem.com/kr/support/product-search/mlcc/CL05A225KP5NSNC.jsp; ComponentLink2Description: Digi-Key Listing; ComponentLink2URL: https://www.digikey.com/product-detail/en/samsung-electro-mechanics-america-inc/CL05A225KP5NSNC/1276-1108-2-ND/3886766; TemperatureCoefficient: X5R; Voltage: 10V; Price: 0.0612; Device Package: 0402 (1005 Metric)
C39 C42 C46 C49 C53 = CC0603ZRY5V8BB104: CAP CER 0.1UF 25V Y5V 0603; Manufacturer: Yageo; TemperatureRange: -30C ~ 85C; TemperatureCoefficient: Y5V (F); Tolerance: -20%, +80%; Value: 0.10uF; Part Number: CC0603ZRY5V8BB104; PartId: 13480; Supplier 1: Digi-Key; Supplier Part Number 1: 311-1087-2-ND; ComponentLink1Description: Datasheet; ComponentLink1URL: http://www.yageo.com/documents/recent/UPY-GPHC_Y5V_6.3V-to-50V_6.pdf; ComponentLink2Description: Digi-Key Listing; ComponentLink2URL: https://www.digikey.com/product-detail/en/yageo/CC0603ZRY5V8BB104/311-1087-2-ND/302821; Voltage: 25V; Price: 0.0036; Device Package: 0603 (1608 Metric)
IC10-IC14 = DMN3150L-7: MOSFET N-CH 28V 3.2A SOT23-3; Manufacturer: Diodes Incorporated; Rds On (Max) at Id, Vgs: 85 mOhm @ 3.6A, 4.5V; Vgs(th) (Max) at Id: 12V; Input Capacitance (Ciss) at Vds: 305pF @ 5V; Current Continuous Drain: 3.8A (Ta); Part Number: DMN3150L-7; PartId: 29528; Supplier 1: Digi-Key; Supplier Part Number 1: DMN3150LDICT-ND; ComponentLink1Description: Datasheet; ComponentLink1URL: http://www.diodes.com/_files/datasheets/ds31126.pdf; ComponentLink2Description: Digi-Key Listing; ComponentLink2URL: https://www.digikey.com/product-detail/en/diodes-incorporated/DMN3150L-7/DMN3150LDICT-ND/1774236; Price: 0.62; Type: N-Channel; Device Package: TO-236-3, SC-59, SOT-23-3; Drain to Source Voltage (Vdss): 28V
LED1-LED6 = SFH4545: Imported; Vendor: Vishay; Built_By: EMA_UL_Team; Type: DEV; C: Copyright (C) 2015 Accelerated Designs. All rights reserved; Manufacturer_Part_Number: SFH4545; RefDes: RefDes; Value: Value; Part Number: SFH4545
Q3-Q9 = TEFT4300: Imported; Vendor: Vishay; Built_By: EMA_UL_Team; Type: DEV; C: Copyright (C) 2015 Accelerated Designs. All rights reserved; Manufacturer_Part_Number: TEFT4300; RefDes: RefDes; Value: Value
R26 R30 R33 R37 R40 = RC0402JR-0710KL: RES SMD 10K OHM 5% 1/16W 0402; Manufacturer: Yageo; TemperatureRange: -55C ~ 155C; TemperatureCoefficient: 100ppm/C; PowerRating: 0.063W, 1/16W; Value: 10k; Part Number: RC0402JR-0710KL; PartId: 14464; Supplier 1: Digi-Key; Supplier Part Number 1: 311-10KJRTR-ND; ComponentLink1Description: Datasheet; ComponentLink1URL: http://www.yageo.com/documents/recent/PYu-RC_Group_51_RoHS_L_04.pdf; ComponentLink2Description: Digi-Key Listing; ComponentLink2URL: https://www.digikey.com/product-detail/en/yageo/RC0402JR-0710KL/311-10KJRTR-ND/726418; Tolerance: 5%; Price: 0.0017; Device Package: 0402 (1005 Metric)
R27 R29 R32 R36 R39 R41 = RC0402JR-071K8L: RES SMD 1.8K OHM 5% 1/16W 0402; Manufacturer: Yageo; TemperatureRange: -55C ~ 155C; TemperatureCoefficient: 100ppm/C; PowerRating: 0.063W, 1/16W; Value: 1.8k; Part Number: RC0402JR-071K8L; PartId: 14530; Supplier 1: Digi-Key; Supplier Part Number 1: 311-1.8KJRTR-ND; ComponentLink1Description: Datasheet; ComponentLink1URL: http://www.yageo.com/documents/recent/PYu-RC_Group_51_RoHS_L_04.pdf; ComponentLink2Description: Digi-Key Listing; ComponentLink2URL: https://www.digikey.com/product-detail/en/yageo/RC0402JR-071K8L/311-1.8KJRTR-ND/726414; Tolerance: 5%; Price: 0.0017; Device Package: 0402 (1005 Metric)
R28 R31 R34 R38 = ERJ-3EKF4701V: RES SMD 4.7K OHM 1% 1/10W 0603; Part Number: RK73B1JTTDD100J; TemperatureRange: -55C ~ 155C; TemperatureCoefficient: 100ppm/C; PowerRating: 0.125W(1/8W); Value: 10; PartId: 890; Supplier 1: Digi-Key; ComponentLink1Description: Datasheet; ComponentLink1URL: http://industrial.panasonic.com/www-cgi/jvcr13pz.cgi?E+PZ+3+AOA0002+ERJ3EKF4701V+7+WW; ComponentLink2Description: Digi-Key listing; ComponentLink2URL: http://digikey.com/product-detail/en/ERJ-3EKF4701V/P4.70KHTR-ND/1746419; Tolerance: 1%; Price: 0.0038; Type: Thick Film; Device Package: 0603 (1608 Metric)
R35 = RC0402JR-074K7L: RES SMD 4.7K OHM 5% 1/16W 0402; Manufacturer: Yageo; TemperatureRange: -55C ~ 155C; TemperatureCoefficient: 100ppm/C; PowerRating: 0.063W, 1/16W; Value: 4.7k; Part Number: RC0402JR-074K7L; PartId: 14466; Supplier 1: Digi-Key; Supplier Part Number 1: 311-4.7KJRTR-ND; ComponentLink1Description: Datasheet; ComponentLink1URL: http://www.yageo.com/documents/recent/PYu-RC_Group_51_RoHS_L_04.pdf; ComponentLink2Description: Digi-Key Listing; ComponentLink2URL: https://www.digikey.com/product-detail/en/yageo/RC0402JR-074K7L/311-4.7KJRTR-ND/726477; Tolerance: 5%; Price: 0.0017; Device Package: 0402 (1005 Metric)
R42 = WSC25155R000FEA: No Description Available; Vendor: Vishay; Built_By: EMA_UL_Team; Manufacturer_Part_Number: WSC25155R000FEA; Copyright: Copyright (C) 2018 Accelerated Designs. All rights reserved; RefDes: RefDes; Type: DEV; Value: 5

## Sheet MCU.SchDoc
size A
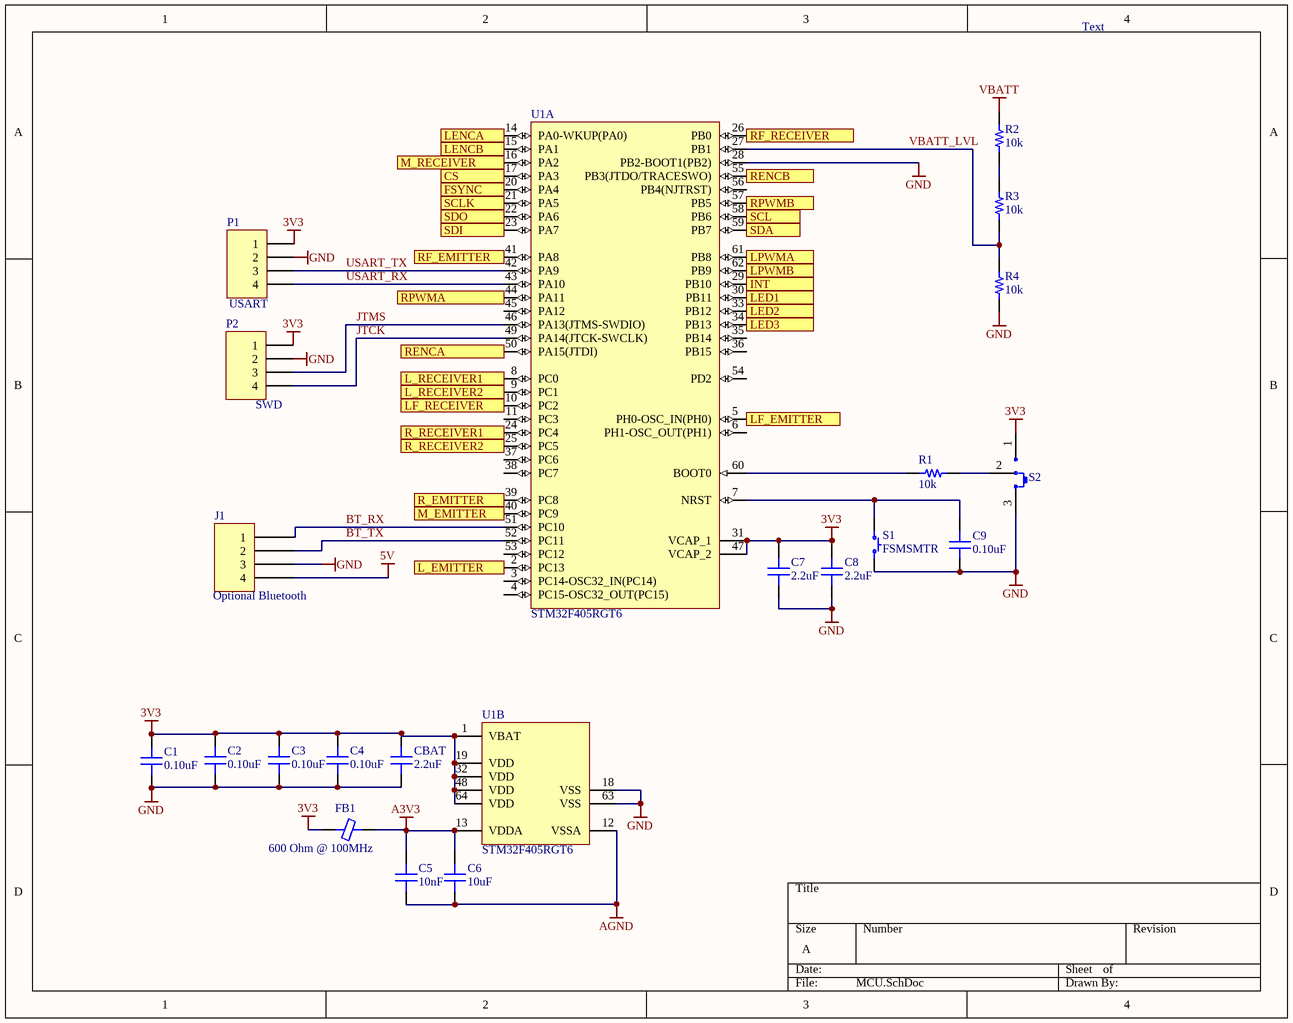
[diagram p4: MCU.SchDoc]

### Parts
C1  0.10uF  [CAP 0402/1005]
C2  0.10uF  [CAP 0402/1005]
C3  0.10uF  [CAP 0402/1005]
C4  0.10uF  [CAP 0402/1005]
C5  10nF  [CAP 0402/1005]
C6  10uF  [CAP 0603/1608]
C7  2.2uF  [CAP 0402/1005]
C8  2.2uF  [CAP 0402/1005]
C9  0.10uF  [CAP 0402/1005]
CBAT  2.2uF  [CAP 0402/1005]
FB1  600 Ohm @ 100MHz  [FER 0603/1608]
J1  NPPN041BFCN-RC  [SULLINS NPPN041BFCN]  (value not drawn)
P1  Header 4  [HDR1X4]  (value not drawn)
P2  (no value)  [HDR1X4]
R1  10k  [RES 0402/1005]
R2  10k  [RES 0402/1005]
R3  10k  [RES 0402/1005]
R4  10k  [RES 0402/1005]
S1  FSMSMTR  [TE FSMSMTR]
S2  SS312SAH4-R  [NKK SS312SAH4]  (value not drawn)
U1  STM32F405RGT6  [STM-LQFP64_N]  (parts A,B of 2)

### Ports
CS (out), FSYNC (out), INT (in), L_EMITTER (out), L_RECEIVER1 (in), L_RECEIVER2 (in), LED1 (out), LED2 (out), LED3 (out), LENCA (in), LENCB (in), LF_EMITTER (out), LF_RECEIVER (in), LPWMA (out), LPWMB (out), M_EMITTER (out), M_RECEIVER (in), R_EMITTER (out), R_RECEIVER1 (in), R_RECEIVER2 (in), RENCA (in), RENCB (in), RF_EMITTER (out), RF_RECEIVER (in), RPWMA (out), RPWMB (out), SCL (out), SCLK (out), SDA (in), SDI (out), SDO (in)

### Nets
3V3: C1.2 C2.2 C3.2 C4.2 C7.2 C8.2 CBAT.2 FB1.2 P1.1 P2.1 S2.1 U1.1(VBAT) U1.19(VDD) U1.31(VCAP_1) U1.32(VDD) U1.47(VCAP_2) U1.48(VDD) U1.64(VDD)
5V: J1.4
A3V3: C5.2 C6.2 FB1.1 U1.13(VDDA)
AGND: C5.1 C6.1 U1.12(VSSA)
GND: C1.1 C2.1 C3.1 C4.1 C7.1 C8.1 C9.1 CBAT.1 J1.3 P1.2 P2.2 R4.1 S1.2 S2.3 U1.18(VSS) U1.28(PB2-BOOT1(PB2)) U1.63(VSS)
VBATT: R2.2
BT_RX: J1.1 U1.51(PC10)
BT_TX: J1.2 U1.52(PC11)
JTCK: P2.4 U1.49(PA14(JTCK-SWCLK))
JTMS: P2.3 U1.46(PA13(JTMS-SWDIO))
USART_RX: P1.4 U1.43(PA10)
USART_TX: P1.3 U1.42(PA9)
VBATT_LVL: R3.1 R4.2 U1.27(PB1)
NetC9_2: C9.2 S1.1 U1.7(NRST)
NetIC1_9: U1.22(PA6) ; port SDO
NetIC1_11: U1.20(PA4) ; port FSYNC
NetIC1_12: U1.29(PB10) ; port INT
NetIC1_22: U1.17(PA3) ; port CS
NetIC1_23: U1.21(PA5) ; port SCLK
NetIC1_24: U1.23(PA7) ; port SDI
NetIC2_1: U1.30(PB11) ; port LED1
NetIC3_1: U1.33(PB12) ; port LED2
NetIC4_1: U1.34(PB13) ; port LED3
NetIC5_2: U1.61(PB8) ; port LPWMA
NetIC5_4: U1.62(PB9) ; port LPWMB
NetIC6_2: U1.44(PA11) ; port RPWMA
NetIC6_4: U1.57(PB5) ; port RPWMB
NetIC10_1: U1.2(PC13) ; port L_EMITTER
NetIC11_1: U1.5(PH0-OSC_IN(PH0)) ; port LF_EMITTER
NetIC12_1: U1.41(PA8) ; port RF_EMITTER
NetIC13_1: U1.39(PC8) ; port R_EMITTER
NetIC14_1: U1.40(PC9) ; port M_EMITTER
NetJ2_4: U1.14(PA0-WKUP(PA0)) ; port LENCA
NetJ2_5: U1.15(PA1) ; port LENCB
NetJ3_4: U1.50(PA15(JTDI)) ; port RENCA
NetJ3_5: U1.55(PB3(JTDO/TRACESWO)) ; port RENCB
NetQ3_1: U1.10(PC2) ; port LF_RECEIVER
NetQ4_1: U1.9(PC1) ; port L_RECEIVER2
NetQ5_1: U1.8(PC0) ; port L_RECEIVER1
NetQ6_1: U1.16(PA2) ; port M_RECEIVER
NetQ7_1: U1.24(PC4) ; port R_RECEIVER1
NetQ8_1: U1.25(PC5) ; port R_RECEIVER2
NetQ9_1: U1.26(PB0) ; port RF_RECEIVER
NetR1_1: R1.1 U1.60(BOOT0)
NetR1_2: R1.2 S2.2(COM)
NetR2_1: R2.1 R3.2
NetR9_1: U1.59(PB7) ; port SDA
NetR11_1: U1.58(PB6) ; port SCL

Not connected (* = marked no-connect by the designer): U1 3(PC14-OSC32_IN(PC14)) 4(PC15-OSC32_OUT(PC15)) 6(PH1-OSC_OUT(PH1)) 11(PC3) 35(PB14) 36(PB15) 37(PC6) 38(PC7) 45(PA12) 53(PC12) 54(PD2) 56(PB4(NJTRST))

### Notes on the sheet
- Text
- (near P1) USART
- (near P2) SWD
- (near J1) Optional Bluetooth

### Library data of the parts
C1-C4 C9 = GCM155R71C104KA55D: as C21 on sheet Motors; Value: 0.10uF; Part Number: GCM155R71C104KA55D; PartId: 12362; Supplier 1: Digi-Key; Supplier Part Number 1: 490-4759-2-ND; ComponentLink1Description: Datasheet; ComponentLink1URL: http://www.murata.com/~/media/webrenewal/support/library/catalog/products/capacitor/mlcc/c03e.ashx; ComponentLink2Description: Digi-Key Listing; ComponentLink2URL: https://www.digikey.com/product-detail/en/murata-electronics-north-america/GCM155R71C104KA55D/490-4759-2-ND/1641633; TemperatureCoefficient: X7R; Voltage: 16V; Price: 0.0088; Device Package: 0402 (1005 Metric)
C5 = CL05B103KO5NNNC: CAP CER 10000PF 16V X7R 0402; Manufacturer: Samsung Electro-Mechanics America, Inc.; TemperatureRange: -55C ~ 125C; Tolerance: 10%; Value: 10nF; Part Number: CL05B103KO5NNNC; PartId: 12520; Supplier 1: Digi-Key; Supplier Part Number 1: 1276-1051-2-ND; ComponentLink1Description: Datasheet; ComponentLink1URL: http://www.samsungsem.com/kr/support/library/product-catalog/__icsFiles/afieldfile/2015/11/18/MLCC.pdf; ComponentLink2Description: Digi-Key Listing; ComponentLink2URL: https://www.digikey.com/product-detail/en/samsung-electro-mechanics-america-inc/CL05B103KO5NNNC/1276-1051-2-ND/3886709; TemperatureCoefficient: X7R; Voltage: 16V; Price: 0.0017; Device Package: 0402 (1005 Metric)
C6 = CL10A106MQ8NNNC: CAP CER 10UF 6.3V X5R 0603; Manufacturer: Samsung Electro-Mechanics America, Inc.; TemperatureRange: -55C ~ 85C; Tolerance: 20%; Value: 10uF; Part Number: CL10A106MQ8NNNC; PartId: 13031; Supplier 1: Digi-Key; Supplier Part Number 1: 1276-1119-2-ND; ComponentLink1Description: Datasheet; ComponentLink1URL: http://www.samsungsem.com/kr/support/product-search/mlcc/CL10A106MQ8NNNC.jsp; ComponentLink2Description: Digi-Key Listing; ComponentLink2URL: https://www.digikey.com/product-detail/en/samsung-electro-mechanics-america-inc/CL10A106MQ8NNNC/1276-1119-2-ND/3886777; TemperatureCoefficient: X5R; Voltage: 6.3V; Price: 0.0274; Device Package: 0603 (1608 Metric)
C7 C8 CBAT = CL05A225KP5NSNC: as C38 on sheet Sensors; Value: 2.2uF; Part Number: CL05A225KP5NSNC; PartId: 12898; Supplier 1: Digi-Key; Supplier Part Number 1: 1276-1108-2-ND; ComponentLink1Description: Datasheet; ComponentLink1URL: http://www.samsungsem.com/kr/support/product-search/mlcc/CL05A225KP5NSNC.jsp; ComponentLink2Description: Digi-Key Listing; ComponentLink2URL: https://www.digikey.com/product-detail/en/samsung-electro-mechanics-america-inc/CL05A225KP5NSNC/1276-1108-2-ND/3886766; TemperatureCoefficient: X5R; Voltage: 10V; Price: 0.0612; Device Package: 0402 (1005 Metric)
FB1 = MMZ1608B301CTAH0: FERRITE CHIP 300 OHM 500MA 0603; Part Number: BK1608HS601-T; DC Resistance: 450mOhm Max; Current Rating: 350mA; Value: 600 Ohm @ 100MHz; ComponentLink1Description: Datasheet; ComponentLink1URL: https://product.tdk.com/info/en/catalog/datasheets/beads_commercial_signal_mmz1608_en.pdf; ComponentLink2Description: Digi-Key listing; ComponentLink2URL: http://digikey.com/product-detail/en/MMZ1608B301CTAH0/445-2165-2-ND/600532; Device Package: 0603 (1608 Metric)
J1 = NPPN041BFCN-RC: CONN RECEPT 2MM SINGLE STR 4POS; Manufacturer: Sullins Connector Solutions; Pitch: 0.079" (2.00mm); Number Of Positions: 4; Part Number: NPPN041BFCN-RC; Colour: Black; PartId: 10883; Supplier 1: Digi-Key; Supplier Part Number 1: S5751-04-ND; ComponentLink1Description: Datasheet; ComponentLink1URL: http://www.sullinscorp.com/drawings/75_1BFC_10483.pdf; ComponentLink2Description: Digi-Key Listing; ComponentLink2URL: http://www.digikey.com/product-detail/en/sullins-connector-solutions/NPPN041BFCN-RC/S5751-04-ND/804806; Price: 0.89; Type: Header; Contact Finish: Gold; Fastening Type: -; Number Of Rows: 1; Series: -
P1 P2 = Header 4: Header, 4-Pin; LatestRevisionDate: 17-Jul-2002; LatestRevisionNote: Re-released for DXP Platform.; Publisher: Altium Limited
R1 = RC0402JR-0710KL: as R26 on sheet Sensors; Value: 10k; Part Number: RC0402JR-0710KL; PartId: 14464; Supplier 1: Digi-Key; Supplier Part Number 1: 311-10KJRTR-ND; ComponentLink1Description: Datasheet; ComponentLink1URL: http://www.yageo.com/documents/recent/PYu-RC_Group_51_RoHS_L_04.pdf; ComponentLink2Description: Digi-Key Listing; ComponentLink2URL: https://www.digikey.com/product-detail/en/yageo/RC0402JR-0710KL/311-10KJRTR-ND/726418; Tolerance: 5%; Price: 0.0017; Device Package: 0402 (1005 Metric)
R2-R4 = ERJ-2RKF1002X: as R15 on sheet Motors; Value: 10k; Part Number: ERJ-2RKF1002X; PartId: 1; Supplier 1: Digi-Key; Supplier Part Number 1: P10.0KLTR-ND; ComponentLink1Description: Datasheet; ComponentLink1URL: http://industrial.panasonic.com/www-cgi/jvcr13pz.cgi?E+PZ+3+AOA0002+ERJ2RKF1002X+7+WW; ComponentLink2Description: Digikey listing; ComponentLink2URL: http://digikey.com/product-detail/en/ERJ-2RKF1002X/P10.0KLTR-ND/192073; Tolerance: 1%; Price: 0.0043; Type: Thick Film; Device Package: 0402 (1005 Metric)
S1 = FSMSMTR: SWITCH TACTILE SPST-NO 0.05A 24V; Manufacturer: TE Connectivity Alcoswitch Switches; Switch Function: Off-Mom; Contact Rating @ Voltage: 0.05A @ 24VDC; Actuator Type: Standard; Actuator Orientation: Top Actuated; Illumination: Non-Illuminated; Operating Force: 180gf; Switch Travel: 0.25mm; Mechanical Life: 20,000 Cycles; Part Number: FSMSMTR; PartId: 8251; Supplier 1: Digi-Key; Supplier Part Number 1: 450-1758-2-ND; ComponentLink1Description: Datasheet; ComponentLink1URL: http://www.te.com/commerce/DocumentDelivery/DDEController?Action=srchrtrv&DocNm=1437566-3&DocType=Customer+Drawing&DocLang=English; ComponentLink2Description: Digi-Key Listing; ComponentLink2URL: http://www.digikey.com/product-detail/en/FSMSMTR/450-1758-2-ND/529671; Price: 0.175; Circuit: SPST-NO; Illumination Voltage: -; Illumination Type, Colour: -; Operating Temperature: -35C ~ 85C
S2 = SS312SAH4-R: SWITCH SLIDE SPDT 0.4VA 28V; Manufacturer: NKK Switches; Switch Function: On-On; Actuator Type: Standard; Switch Travel: 2.00mm; Mechanical Life: 10,000 Cycles; Part Number: SS312SAH4-R; PartId: 16471; Supplier 1: Digi-Key; Supplier Part Number 1: 360-2924-2-ND; ComponentLink1Description: Datasheet; ComponentLink1URL: http://2t70un3m1d9z1kztamkdrd38.wpengine.netdna-cdn.com/wp-content/uploads/2016/02/SS3surfaceMount.pdf; ComponentLink2Description: Digi-Key Listing; ComponentLink2URL: http://www.digikey.com/product-detail/en/nkk-switches/SS312SAH4-R/360-2924-2-ND/2810472; Price: 1.953; TYPE: Slide Switches; Series: SS3; Circuit: SPDT; Operating Force: -; Operating Temperature: -25C ~ 85C
U1 = STM32F405RGT6: ARM Cortex-M4 32-bit MCU+FPU, 210 DMIPS, 1024 kB Flash, 192 kB Internal RAM, 51 I/Os, 64-pin LQFP, -40 to 85 degC, Tray; Manufacturer: STMicroelectronics; D/A Converter: 2x12-bit; FLASH Size (Prog) (kB): 1024; I/Os (High Current): 51; Internal RAM Size (kB): 192; Operating Frequency(F) (Processor speed) (MHz): 168; Supply Voltage(Vcc) max (V): 3.6; Supply Voltage(Vcc) min (V): 1.8; DatasheetVersion: Rev. 4; PackageVersion: Rev. 4, 06/2013; PackageReference: LQFP64; PackageDescription: 64-Pin Low Profile Quad Flat Package, 10 x 10 mm Body, 0.5 mm Pitch; Supplier 1: Digi-Key; Supplier Part Number 1: 497-11767-ND; Supplier 2: Farnell; Supplier Part Number 2: 2064363; Supplier 3: Newark; Supplier Part Number 3: 73T2329; Supplier 4: Mouser; Supplier Part Number 4: 511-STM32F405RGT6; Core: ARM Cortex-M4; Packing: Tray; Mounting Technology: Surface Mount; PartNumber: STM32F405RGT6; ComponentLink1Description: Manufacturer URL; ComponentLink1URL: http://www.st.com/web/en/home.html; ComponentLink2Description: Datasheet; ComponentLink2URL: http://www.st.com/st-web-ui/static/active/en/resource/technical/document/datasheet/DM00037051.pdf; ComponentLink3Description: Package Specification; ComponentLink3URL: http://www.st.com/st-web-ui/static/active/en/resource/technical/document/datasheet/DM00037051.pdf; Part Number: STM32F405RGT6